# Altium schematic sheet QVGA.SchDoc
size A4
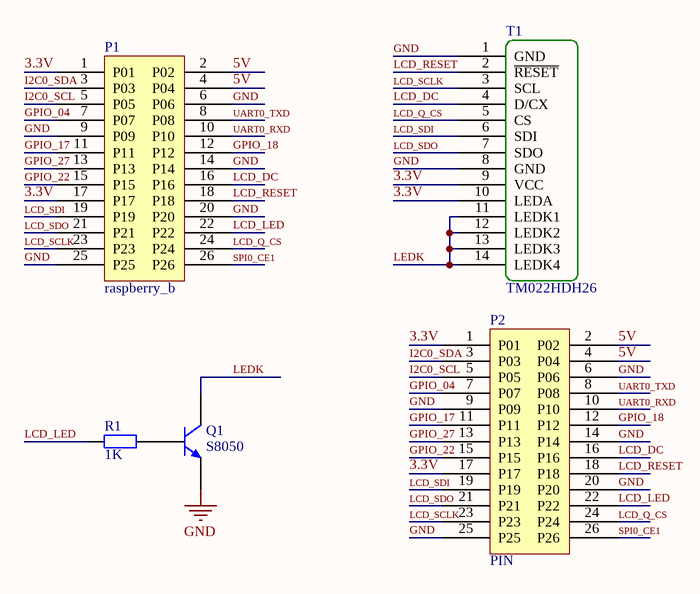
[diagram p0: QVGA.SchDoc]

## Parts
P1  raspberry_b  [GPIO13x2]
P2  PIN  [GPIO13x2]
Q1  S8050  [SOT23 - duplicate]
R1  1K  [1206]
T1  TM022HDH26  [TM022HDH26]

## Nets
GND: P1.6(P06) P1.9(P09) P1.14(P14) P1.20(P20) P1.25(P25) P2.6(P06) P2.9(P09) P2.14(P14) P2.20(P20) P2.25(P25) Q1.1(E) T1.1(GND) T1.8(GND)
3.3V: P1.1(P01) P1.17(P17) P2.1(P01) P2.17(P17) T1.9(VCC) T1.10(LEDA)
5V: P1.2(P02) P1.4(P04) P2.2(P02) P2.4(P04)
GPIO_04: P1.7(P07) P2.7(P07)
GPIO_17: P1.11(P11) P2.11(P11)
GPIO_18: P1.12(P12) P2.12(P12)
GPIO_22: P1.15(P15) P2.15(P15)
GPIO_27: P1.13(P13) P2.13(P13)
I2C0_SCL: P1.5(P05) P2.5(P05)
I2C0_SDA: P1.3(P03) P2.3(P03)
LCD_DC: P1.16(P16) P2.16(P16) T1.4(D/CX)
LCD_LED: P1.22(P22) P2.22(P22) R1.1
LCD_Q_CS: P1.24(P24) P2.24(P24) T1.5(CS)
LCD_RESET: P1.18(P18) P2.18(P18) T1.2(~{RESET})
LCD_SCLK: P1.23(P23) P2.23(P23) T1.3(SCL)
LCD_SDI: P1.19(P19) P2.19(P19) T1.6(SDI)
LCD_SDO: P1.21(P21) P2.21(P21) T1.7(SDO)
LEDK: Q1.3(C) T1.11(LEDK1) T1.12(LEDK2) T1.13(LEDK3) T1.14(LEDK4)
SPI0_CE1: P1.26(P26) P2.26(P26)
UART0_RXD: P1.10(P10) P2.10(P10)
UART0_TXD: P1.8(P08) P2.8(P08)
NetQ1_2: Q1.2(B) R1.2

## Library data of the parts
P2 = raspberry_b
R1 = register
T1 = TM022HDH26: 2.2寸无触摸